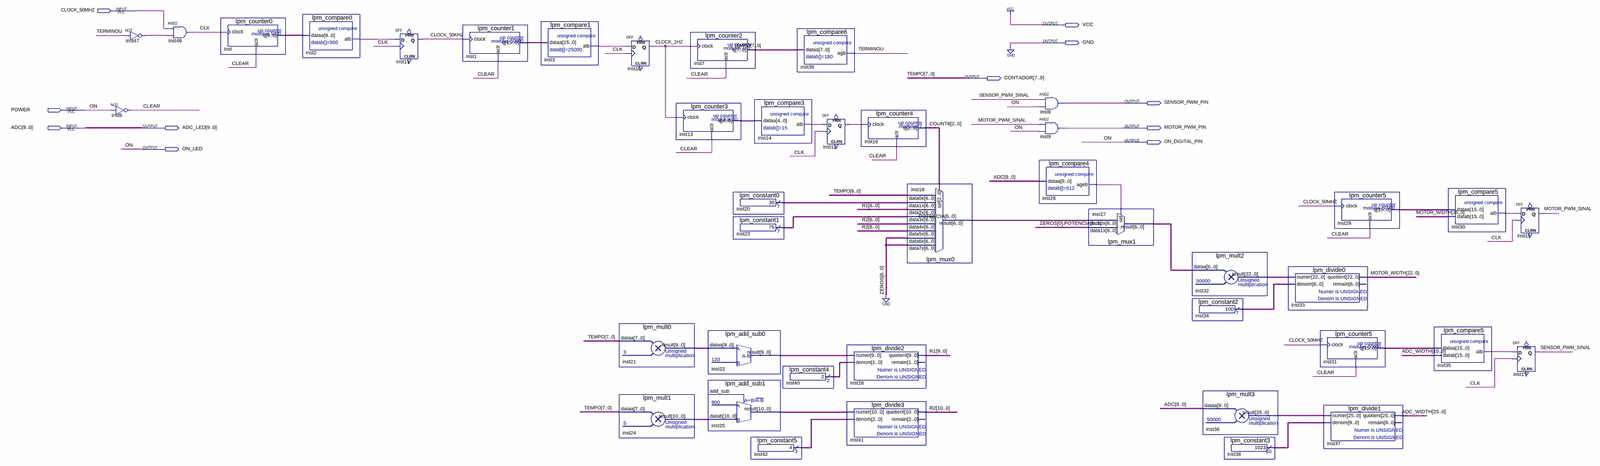
[diagram p0: schematic sheet, whole]
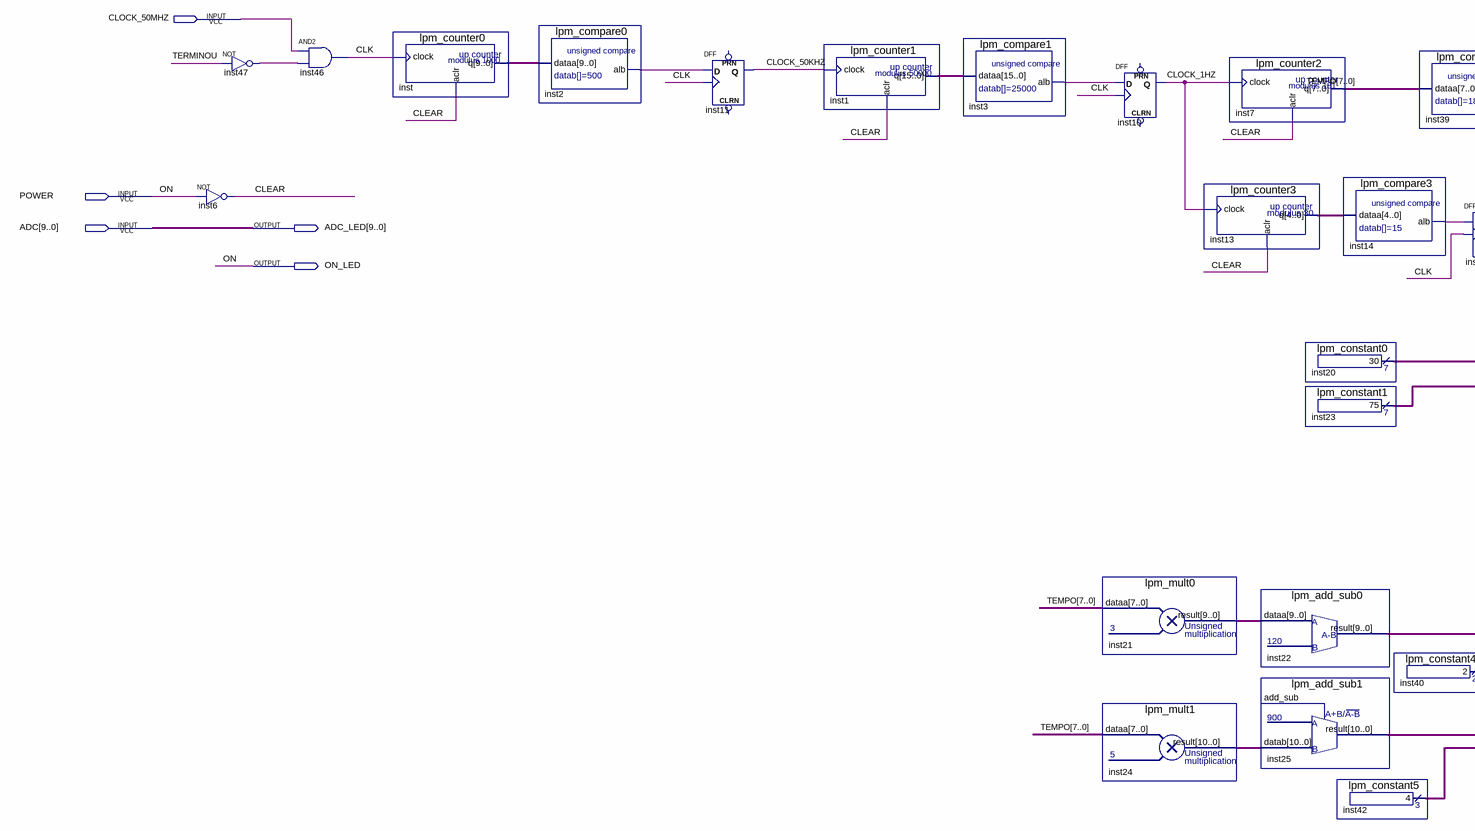
[diagram p1: schematic sheet, left part]
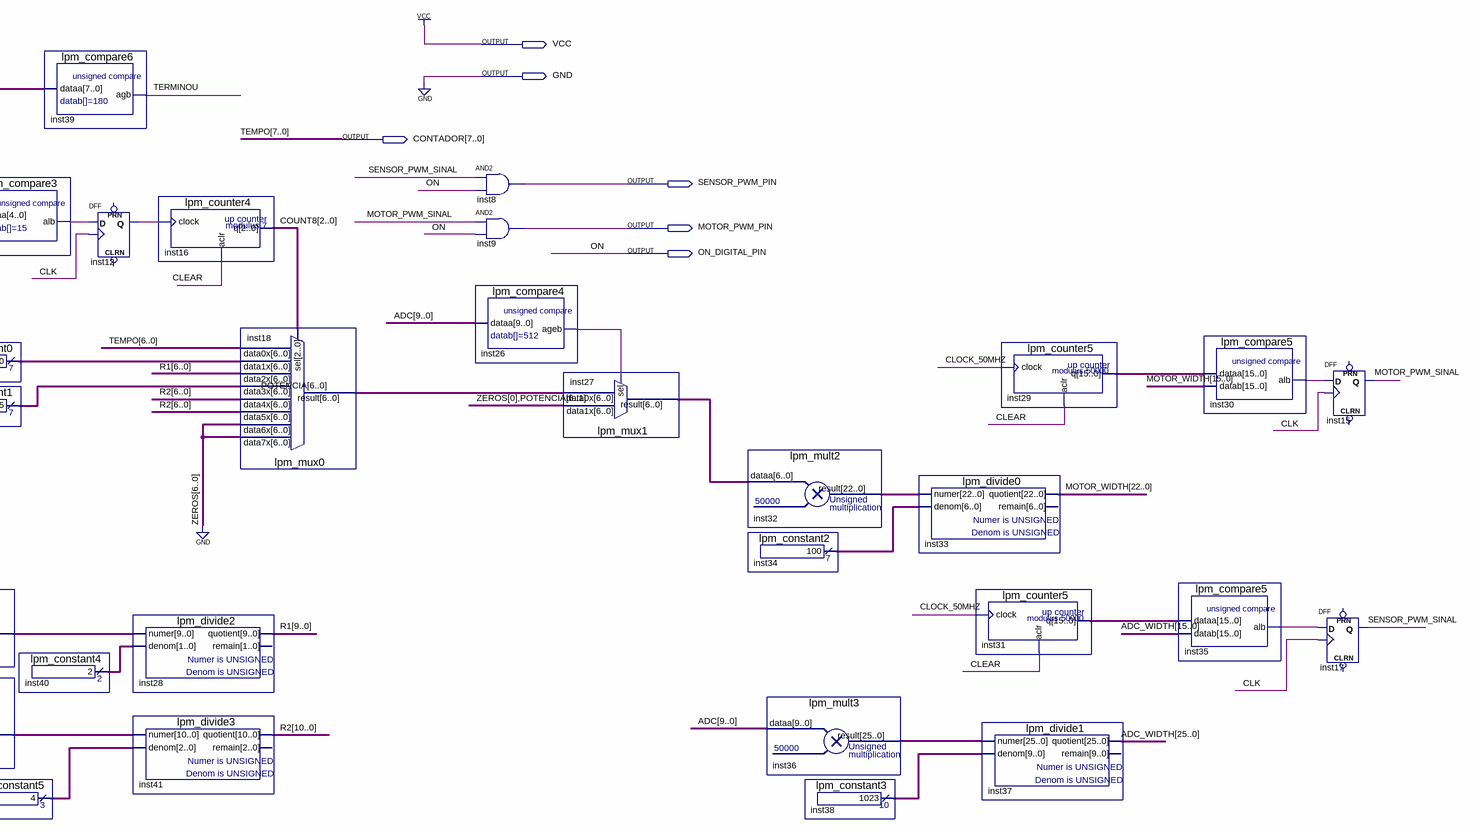
[diagram p2: schematic sheet, right part]
// Quartus schematic Projeto3U.bdf as structural Verilog: 42 symbols, 11 pins
module Projeto3U (
  input  CLOCK_50MHZ,
  input  POWER,
  input  [9:0] ADC,
  output VCC,
  output GND,
  output [7:0] CONTADOR,
  output SENSOR_PWM_PIN,
  output [9:0] ADC_LED,
  output MOTOR_PWM_PIN,
  output ON_DIGITAL_PIN,
  output ON_LED
);

  wire CLEAR, CLK, CLOCK_1HZ, CLOCK_50KHZ, inst2_alb, inst3_alb, inst12_q, inst14_alb, inst26_ageb,
       inst30_alb, inst35_alb, inst47_out, MOTOR_PWM_SINAL, SENSOR_PWM_SINAL, TERMINOU;
  wire [1:0] inst40_result;
  wire [2:0] COUNT8, inst42_result;
  wire [4:0] inst13_q;
  wire [6:0] inst20_result, inst23_result, inst27_result, inst34_result, POTENCIA;
  wire [9:0] inst21_result, inst22_result, inst38_result, inst_q, R1;
  wire [10:0] inst24_result, inst25_result, R2;
  wire [15:0] inst1_q, inst29_q, inst31_q;
  wire [22:0] inst32_result, MOTOR_WIDTH;
  wire [25:0] ADC_WIDTH, inst36_result;

  not inst47 (inst47_out, TERMINOU);
  not inst6 (CLEAR, POWER);
  and inst46 (CLK, CLOCK_50MHZ, inst47_out);
  lpm_counter0 inst (.clock(CLK), .aclr(CLEAR), .q(inst_q));
  lpm_compare0 inst2 (.dataa(inst_q), .alb(inst2_alb));
  DFF inst11 (.CLK(CLK), .D(inst2_alb), .Q(CLOCK_50KHZ));  // open: CLRN, PRN
  lpm_counter1 inst1 (.clock(CLOCK_50KHZ), .aclr(CLEAR), .q(inst1_q));
  lpm_compare1 inst3 (.dataa(inst1_q), .alb(inst3_alb));
  lpm_mult0 inst21 (.dataa(CONTADOR), .result(inst21_result));
  lpm_mult1 inst24 (.dataa(CONTADOR), .result(inst24_result));
  DFF inst10 (.CLK(CLK), .D(inst3_alb), .Q(CLOCK_1HZ));  // open: CLRN, PRN
  lpm_counter3 inst13 (.clock(CLOCK_1HZ), .aclr(CLEAR), .q(inst13_q));
  lpm_counter2 inst7 (.clock(CLOCK_1HZ), .aclr(CLEAR), .q(CONTADOR));
  lpm_constant0 inst20 (.result(inst20_result));
  lpm_constant1 inst23 (.result(inst23_result));
  lpm_add_sub0 inst22 (.dataa(inst21_result), .result(inst22_result));
  lpm_add_sub1 inst25 (.datab(inst24_result), .result(inst25_result));  // open: add_sub
  lpm_compare3 inst14 (.dataa(inst13_q), .alb(inst14_alb));
  lpm_constant5 inst42 (.result(inst42_result));
  lpm_constant4 inst40 (.result(inst40_result));
  lpm_compare6 inst39 (.dataa(CONTADOR), .agb(TERMINOU));
  DFF inst12 (.CLK(CLK), .D(inst14_alb), .Q(inst12_q));  // open: CLRN, PRN
  lpm_divide2 inst28 (.numer(inst22_result), .denom(inst40_result), .quotient(R1));  // open: remain
  lpm_divide3 inst41 (.numer(inst25_result), .denom(inst42_result), .quotient(R2));  // open: remain
  lpm_counter4 inst16 (.clock(inst12_q), .aclr(CLEAR), .q(COUNT8));
  lpm_mux0 inst18 (
    .data7x({7{1'b0}}), .data6x({7{1'b0}}), .data5x(R2[6:0]), .data4x(R2[6:0]), .data3x(inst23_result),
    .data2x(R1[6:0]), .data1x(inst20_result), .data0x(CONTADOR[6:0]), .sel(COUNT8), .result(POTENCIA));
  and inst8 (SENSOR_PWM_PIN, SENSOR_PWM_SINAL, POWER);
  and inst9 (MOTOR_PWM_PIN, MOTOR_PWM_SINAL, POWER);
  lpm_compare4 inst26 (.dataa(ADC), .ageb(inst26_ageb));
  lpm_mux1 inst27 (.data1x({1'b0, POTENCIA[6:1]}), .data0x(POTENCIA), .sel(inst26_ageb), .result(inst27_result));
  lpm_mult2 inst32 (.dataa(inst27_result), .result(inst32_result));
  lpm_constant2 inst34 (.result(inst34_result));
  lpm_mult3 inst36 (.dataa(ADC), .result(inst36_result));
  lpm_constant3 inst38 (.result(inst38_result));
  lpm_divide0 inst33 (.numer(inst32_result), .denom(inst34_result), .quotient(MOTOR_WIDTH));  // open: remain
  lpm_counter5 inst31 (.clock(CLOCK_50MHZ), .aclr(CLEAR), .q(inst31_q));
  lpm_divide1 inst37 (.numer(inst36_result), .denom(inst38_result), .quotient(ADC_WIDTH));  // open: remain
  lpm_counter5 inst29 (.clock(CLOCK_50MHZ), .aclr(CLEAR), .q(inst29_q));
  lpm_compare5 inst35 (.dataa(inst31_q), .datab(ADC_WIDTH[15:0]), .alb(inst35_alb));
  lpm_compare5 inst30 (.dataa(inst29_q), .datab(MOTOR_WIDTH[15:0]), .alb(inst30_alb));
  DFF inst15 (.CLK(CLK), .D(inst30_alb), .Q(MOTOR_PWM_SINAL));  // open: CLRN, PRN
  DFF inst17 (.CLK(CLK), .D(inst35_alb), .Q(SENSOR_PWM_SINAL));  // open: CLRN, PRN

  assign ADC_LED = ADC;
  assign GND = 1'b0;
  assign ON_DIGITAL_PIN = POWER;
  assign ON_LED = POWER;
  assign VCC = 1'b1;

  // Other names for the same wires on the sheet: ON = POWER; TEMPO[7:0] = CONTADOR
endmodule
